# EAGLE design hoekdrive17-test-fixture (EAGLE 5.12)
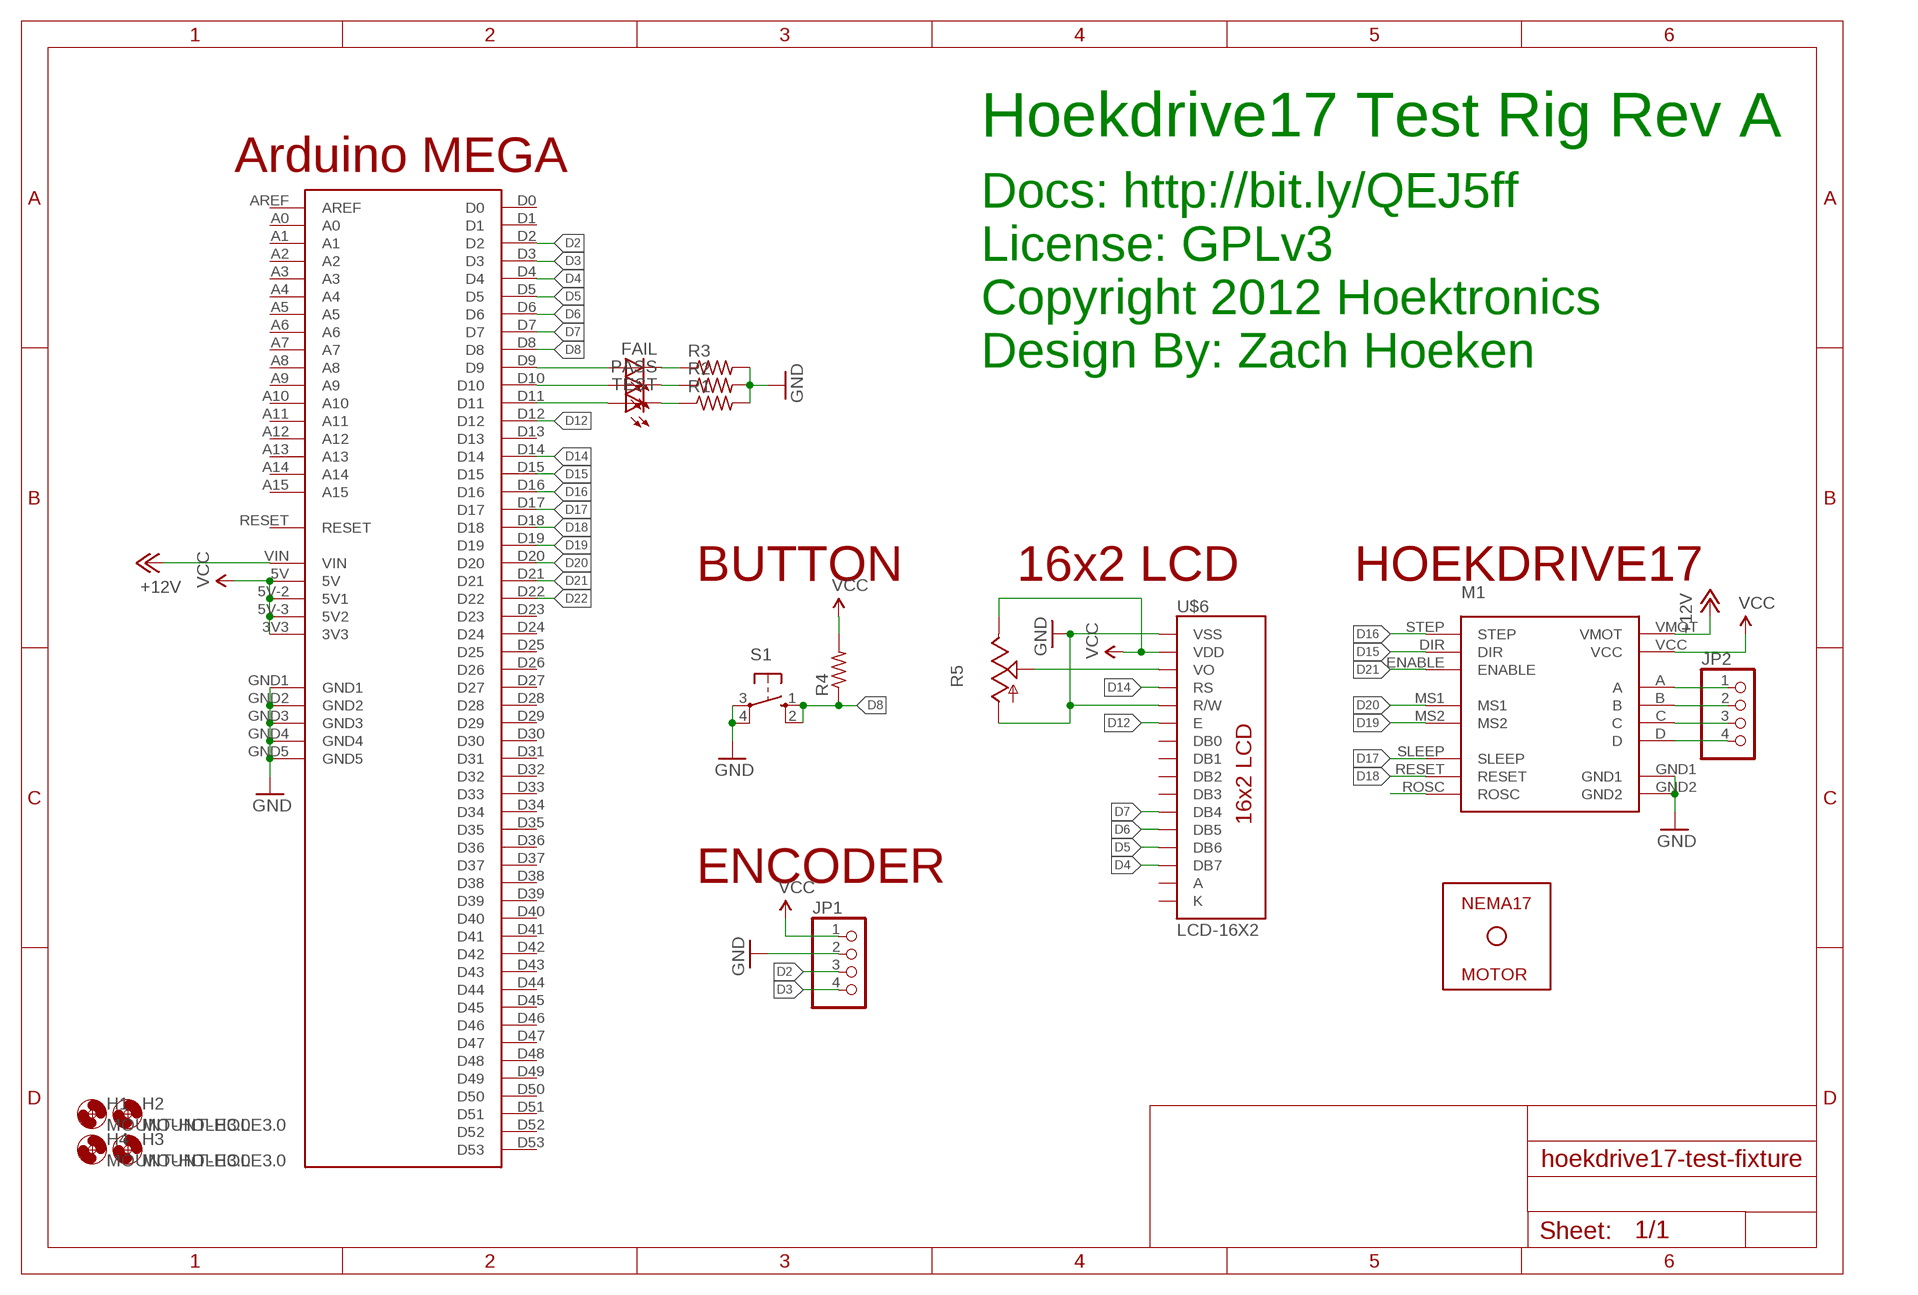
[diagram p0: schematic, sheet 1]

## Parts
FAIL  LED10MM  [LED10MM]
H1  MOUNT-HOLE3.0  [3,0]
H2  MOUNT-HOLE3.0  [3,0]
H3  MOUNT-HOLE3.0  [3,0]
H4  MOUNT-HOLE3.0  [3,0]
JP1  PINHD-1X4  [1X04]
JP2  PINHD-1X4  [1X04]
M1  HOEKSTEP17  [HOEKSTEP17]
PASS  LED10MM  [LED10MM]
R1  R-US_0207/7  [0207/7]
R2  R-US_0207/7  [0207/7]
R3  R-US_0207/7  [0207/7]
R4  R-US_0207/7  [0207/7]
R5  TRIM_US-B25U  [B25U]
S1  40-XX  [B3F-40XX]
TEST  LED10MM  [LED10MM]
U$1  ARDUINO-MEGA  [ARDUINO-MEGA]
U$3  NEMA17  [NEMA17]
U$6  LCD-16X2  [LCD-16X2]

## Nets
+12V: M1.VMOT U$1.VIN
D2: JP1.3 U$1.D2
D3: JP1.4 U$1.D3
D4: U$1.D4 U$6.14(DB7)
D5: U$1.D5 U$6.13(DB6)
D6: U$1.D6 U$6.12(DB5)
D7: U$1.D7 U$6.11(DB4)
D8: R4.1 S1.1(S) S1.2(S1) U$1.D8
D12: U$1.D12 U$6.6(E)
D14: U$1.D14 U$6.4(RS)
D15: M1.DIR U$1.D15
D16: M1.STEP U$1.D16
D17: M1.SLEEP U$1.D17
D18: M1.RESET U$1.D18
D19: M1.MS2 U$1.D19
D20: M1.MS1 U$1.D20
D21: M1.ENABLE U$1.D21
D22: U$1.D22
GND: JP1.2 M1.GND1 M1.GND2 R1.2 R2.2 R3.2 R5.A S1.3(P) S1.4(P1) U$1.GND1 U$1.GND2 U$1.GND3 U$1.GND4 U$1.GND5 U$6.1(VSS) U$6.5(R/W)
N$1: JP2.1 M1.A
N$2: JP2.2 M1.B
N$3: JP2.3 M1.C
N$4: JP2.4 M1.D
N$5: FAIL.A U$1.D9
N$6: PASS.A U$1.D10
N$7: TEST.A U$1.D11
N$8: FAIL.C R3.1
N$9: PASS.C R2.1
N$10: R1.1 TEST.C
N$18: M1.ROSC
N$19: R5.S U$6.3(VO)
VCC: JP1.1 M1.VCC R4.2 R5.E U$1.3V3 U$1.5V U$1.5V-2(5V1) U$1.5V-3(5V2) U$6.2(VDD)
Unconnected: U$1.A0 U$1.A1 U$1.A2 U$1.A3 U$1.A4 U$1.A5 U$1.A6 U$1.A7 U$1.A8 U$1.A9 U$1.A10 U$1.A11 U$1.A12 U$1.A13 U$1.A14 U$1.A15 U$1.AREF U$1.D0 U$1.D1 U$1.D13 U$1.D23 U$1.D24 U$1.D25 U$1.D26 U$1.D27 U$1.D28 U$1.D29 U$1.D30 U$1.D31 U$1.D32 U$1.D33 U$1.D34 U$1.D35 U$1.D36 U$1.D37 U$1.D38 U$1.D39 U$1.D40 U$1.D41 U$1.D42 U$1.D43 U$1.D44 U$1.D45 U$1.D46 U$1.D47 U$1.D48 U$1.D49 U$1.D50 U$1.D51 U$1.D52 U$1.D53 U$1.RESET U$6.7(DB0) U$6.8(DB1) U$6.9(DB2) U$6.10(DB3)

## Notes on the sheet
- Hoekdrive17 Test Rig Rev A
- Arduino MEGA
- Docs: http://bit.ly/QEJ5ff
- License: GPLv3
- Copyright 2012 Hoektronics
- Design By: Zach Hoeken
- BUTTON | 16x2 LCD | HOEKDRIVE17
- ENCODER

## Power pins joined to a net without a drawn wire
A: U$6.15(A)
K: U$6.16(K)

## Library data of the parts
FAIL PASS TEST = SparkFun:LED: LEDs Standard schematic elements and footprints for 5mm, 3mm, 1206, and 0603 sized LEDs. 5mm - Spark Fun Electronics SKU : COM-00529 (and others)
H1-H4 = holes:MOUNT-HOLE: MOUNTING HOLE with drill center marker
JP1 JP2 = pinhead:PINHD-1X4: PIN HEADER
M1 = Hoektronics:HOEKSTEP17
R1-R4 = resistor:R-US_: RESISTOR, American symbol
R5 = pot:TRIM_US-: POTENTIOMETER
S1 = switch-omron:40-XX: OMRON SWITCH; MF: OMRON COMPONENTS USA; MPN: B3F-4000; OC_FARNELL: 176434; OC_NEWARK: 36K3105
U$1 = MakerBot:ARDUINO-MEGA
U$3 = Hoektronics:NEMA17
U$6 = SparkFun:LCD-16X2

## Net classes
0 default: width 0.381 mm, clearance 0.381 mm

## Board
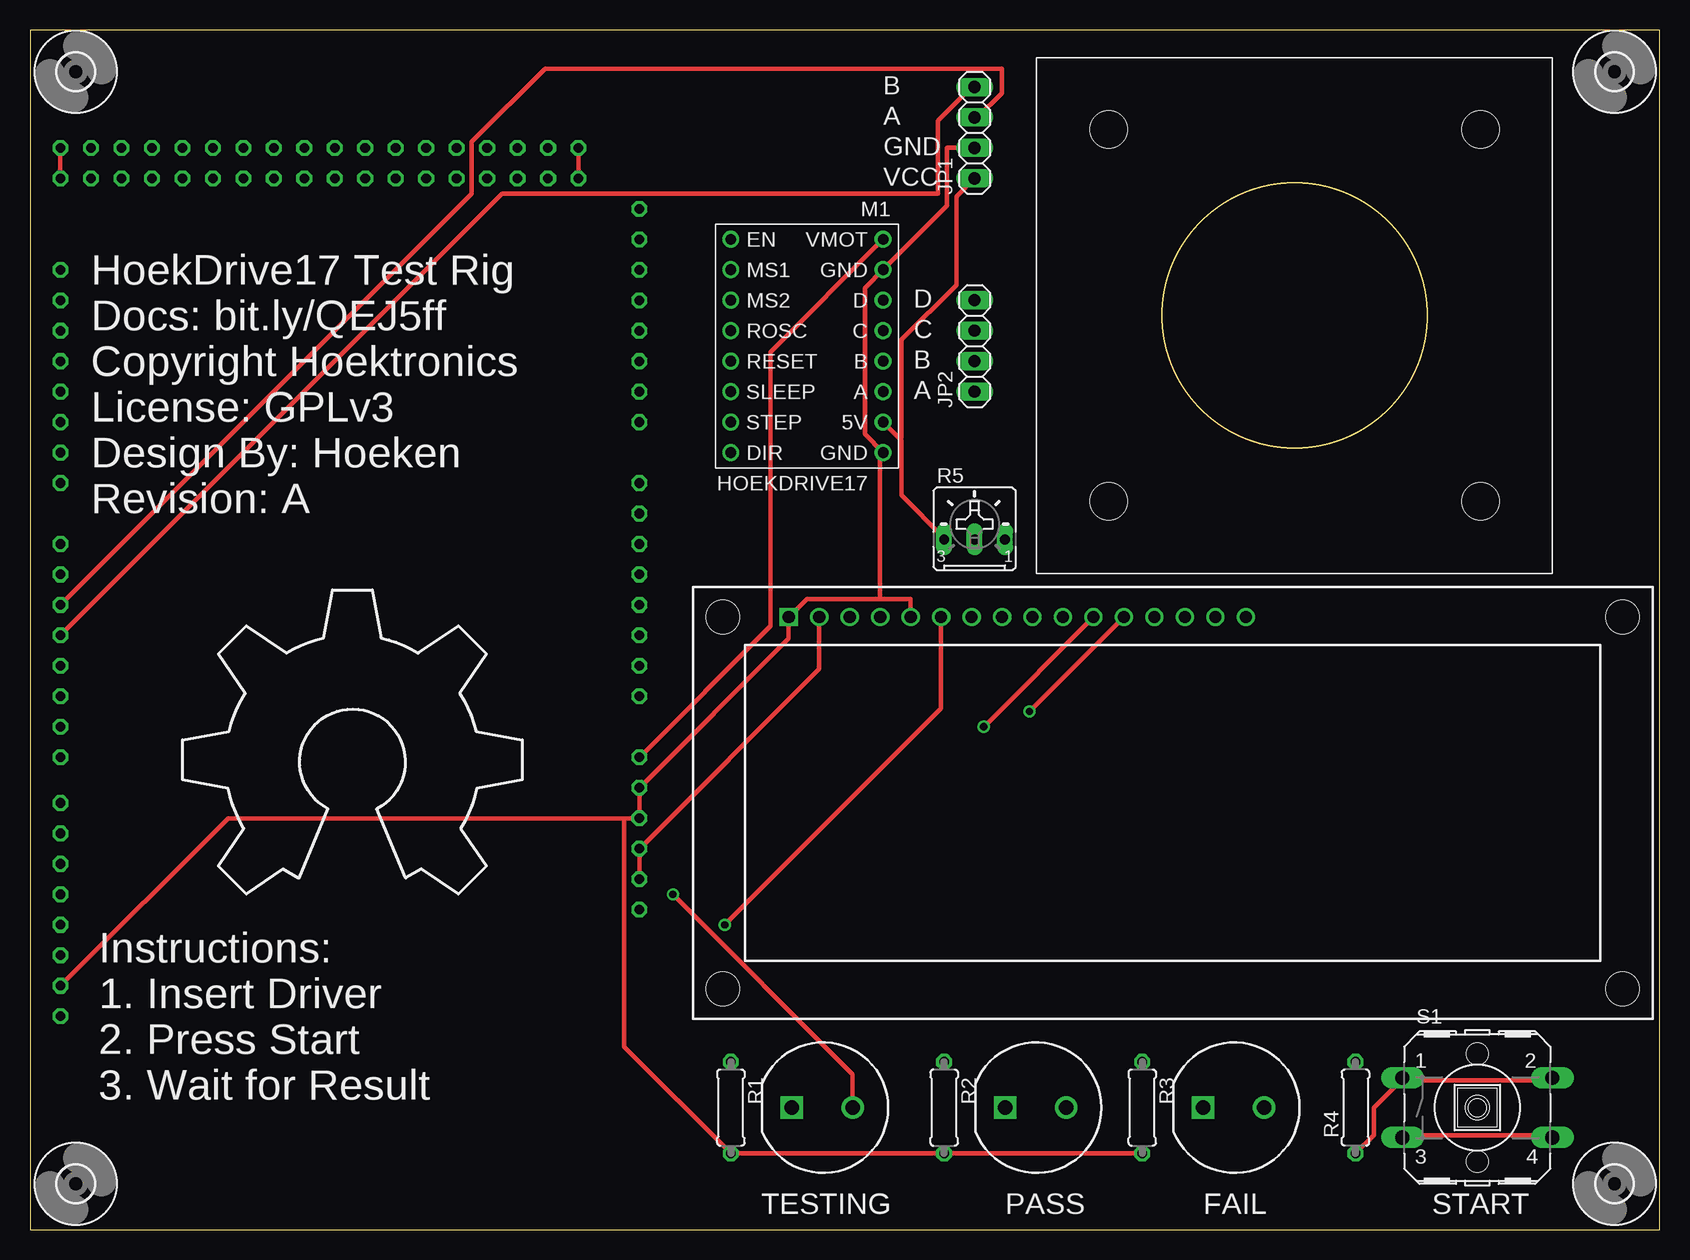
[diagram p1: board, top side]
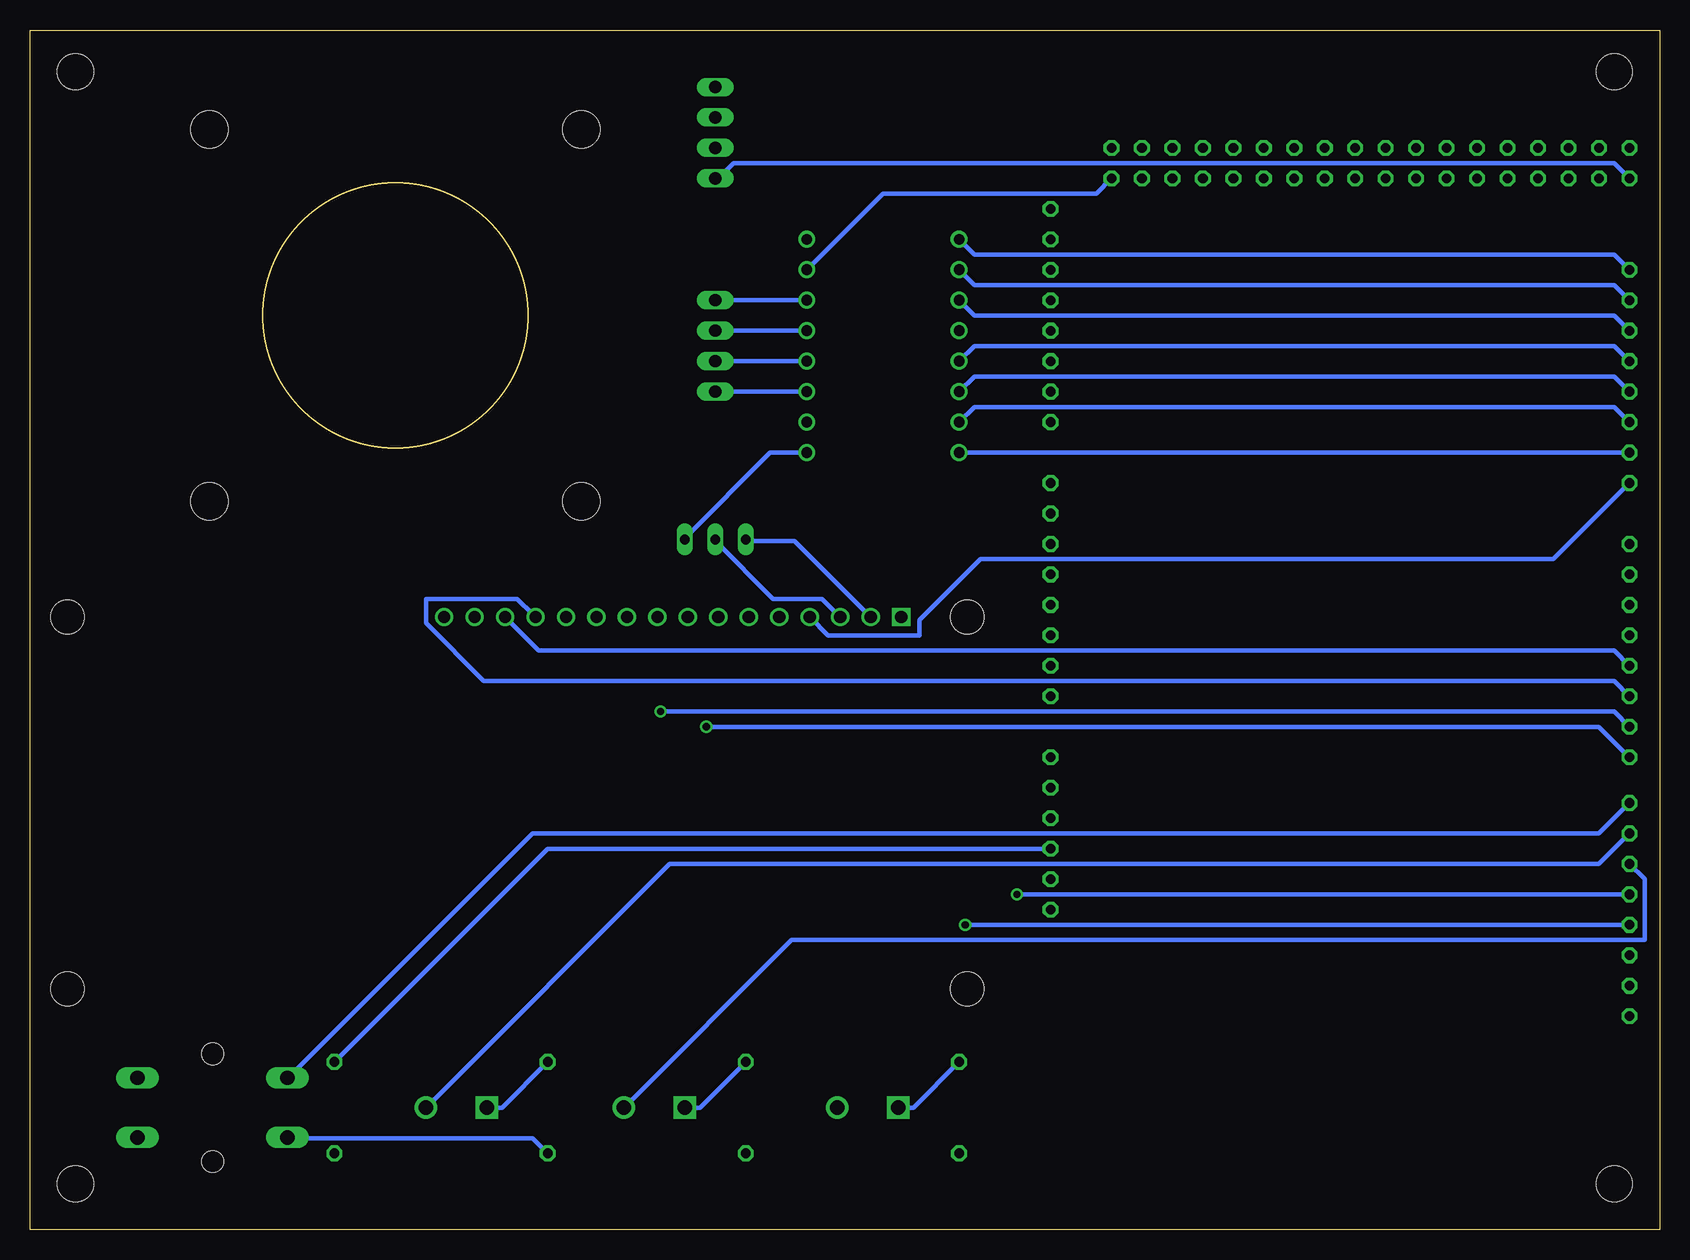
[diagram p2: board, bottom side, seen from below]

Size 135.87 x 100 mm. Coordinates in mm from the lower left corner, seen from the top.
Outline: 0,0 135.87,0 135.87,100 0,100 0,0
Copper layers (1*16): Top 0.035mm / dielectric 1.5mm / Bottom 0.035mm
Design rules "default": minimum track width 10mil, minimum drill 24mil, track to track 8mil, track to pad 8mil, pad to pad 8mil, via to via 8mil, smd to smd 8mil, copper to edge 40mil, drill to drill 8mil, minimum pad ring 10mil, minimum via ring 8mil, stop-mask expansion 4mil, vias tented up to drill 0mil, thermal gap 10mil

### Footprints (pad centres in the part's own frame; a part is rotated, then mirrored left to right if it is on the bottom)
LED10MM = drill 1.2 pad 1.88 round: A 2.54,0 | drill 1.2 pad 1.88 square: C -2.54,0
3,0 = hole 3: 0,0
1X04 = drill 1.016 long: 1 -3.81,0; 2 -1.27,0; 3 1.27,0; 4 3.81,0
HOEKSTEP17 = drill 0.9 round: A -6.35,-5.08; B -6.35,-7.62; C -6.35,-10.16; D -6.35,-12.7; DIR 6.35,0; ENABLE 6.35,-17.78; GND1 -6.35,0; GND2 -6.35,-15.24; MS1 6.35,-15.24; MS2 6.35,-12.7; RESET 6.35,-7.62; ROSC 6.35,-10.16; SLEEP 6.35,-5.08; STEP 6.35,-2.54; VCC -6.35,-2.54; VMOT -6.35,-17.78
0207/7 = drill 0.813 octagon: 1 -3.81,0; 2 3.81,0
B25U = drill 0.813 long: A 2.54,-0.889; E -2.54,-0.889; S 0,-0.889
B3F-40XX = drill 1.194 long: 1 -6.248,2.489; 2 6.248,2.489; 3 -6.248,-2.489; 4 6.248,-2.489 | hole 1.803: 0,-4.496; 0,4.496
ARDUINO-MEGA = drill 0.8 octagon: 3V3 35.56,2.54; 5V 93.98,50.8; 5V-2 96.52,50.8; 5V-3 38.1,2.54; A0 50.8,2.54; A1 53.34,2.54; A2 55.88,2.54; A3 58.42,2.54; A4 60.96,2.54; A5 63.5,2.54; A6 66.04,2.54; A7 68.58,2.54; A8 73.66,2.54; A9 76.2,2.54; A10 78.74,2.54; A11 81.28,2.54; A12 83.82,2.54; A13 86.36,2.54; A14 88.9,2.54; A15 91.44,2.54; AREF 24.13,50.8; D0 63.5,50.8; D1 60.96,50.8; D2 58.42,50.8; D3 55.88,50.8; D4 53.34,50.8; D5 50.8,50.8; D6 48.26,50.8; D7 45.72,50.8; D8 41.91,50.8; D9 39.37,50.8; D10 36.83,50.8; D11 34.29,50.8; D12 31.75,50.8; D13 29.21,50.8; D14 68.58,50.8; D15 71.12,50.8; D16 73.66,50.8; D17 76.2,50.8; D18 78.74,50.8; D19 81.28,50.8; D20 83.82,50.8; D21 86.36,50.8; D22 93.98,48.26; D23 96.52,48.26; D24 93.98,45.72; D25 96.52,45.72; D26 93.98,43.18; D27 96.52,43.18; D28 93.98,40.64; D29 96.52,40.64; D30 93.98,38.1; D31 96.52,38.1; D32 93.98,35.56; D33 96.52,35.56; D34 93.98,33.02; D35 96.52,33.02; D36 93.98,30.48; D37 96.52,30.48; D38 93.98,27.94; D39 96.52,27.94; D40 93.98,25.4; D41 96.52,25.4; D42 93.98,22.86; D43 96.52,22.86; D44 93.98,20.32; D45 96.52,20.32; D46 93.98,17.78; D47 96.52,17.78; D48 93.98,15.24; D49 96.52,15.24; D50 93.98,12.7; D51 96.52,12.7; D52 93.98,10.16; D53 96.52,10.16; GND1 26.67,50.8; GND2 93.98,7.62; GND3 96.52,7.62; GND4 40.64,2.54; GND5 43.18,2.54; RESET 33.02,2.54; VIN 45.72,2.54
NEMA17 = hole 3.1: 15.5,-15.5; 15.5,15.5; -15.5,15.5; -15.5,-15.5
LCD-16X2 = drill 1.016 square: 1 -32,15.5 | drill 1.016 round: 2 -29.46,15.5; 3 -26.92,15.5; 4 -24.38,15.5; 5 -21.84,15.5; 6 -19.3,15.5; 7 -16.76,15.5; 8 -14.22,15.5; 9 -11.68,15.5; 10 -9.14,15.5; 11 -6.6,15.5; 12 -4.06,15.5; 13 -1.52,15.5; 14 1.02,15.5; 15 3.56,15.5; 16 6.1,15.5 | hole 2.8: -37.5,15.5; -37.5,-15.5; 37.5,15.5; 37.5,-15.5

### Placement (x,y rotation side)
FAIL  100.33,10.16 0 top
H1  3.81,3.81 0 top
H2  132.08,3.81 0 top
H3  132.08,96.52 0 top
H4  3.81,96.52 0 top
JP1  78.74,91.44 90 top
JP2  78.74,73.66 90 top
M1  64.77,64.77 180 top
PASS  83.82,10.16 0 top
R1  58.42,10.16 270 top
R2  76.2,10.16 270 top
R3  92.71,10.16 270 top
R4  110.49,10.16 90 top
R5  78.74,58.42 0 top
S1  120.65,10.16 0 top
TEST  66.04,10.16 0 top
U$1  53.34,-6.35 90 top
U$2  [OSHW_10X1000_NOTEXT]  12.7,27.94 0 top
U$3  105.41,76.2 0 top
U$6  95.25,35.56 0 top

### Tracks (layer width: path | path; a pad name or v marks a point on that pad's centre or on a via)
+12V
  Top 0.381: U$1.VIN 61.72,50.29 61.72,73.15 M1.VMOT
D2
  Top 0.381: U$1.D2 36.83,86.36 36.83,90.68 42.93,96.77 81.03,96.77 81.03,94.74 78.99,92.71 JP1.3
D3
  Top 0.381: U$1.D3 39.37,86.36 75.69,86.36 75.69,92.46 78.49,95.25 JP1.4
D4
  Bottom 0.381: U$1.D4 3.81,48.26 93.47,48.26 U$6.14
D5
  Bottom 0.381: U$1.D5 3.81,45.72 98.04,45.72 102.87,50.55 102.87,52.58 95.25,52.58 93.98,51.31 U$6.13
D6  (via drill 0.61)
  Top 0.381: v83.31,43.18 U$6.12
  Bottom 0.381: U$1.D6 3.81,43.18 v83.31,43.18
D7  (via drill 0.61)
  Top 0.381: v79.5,41.91 U$6.11
  Bottom 0.381: U$1.D7 5.08,41.91 v79.5,41.91
D8
  Top 0.381: R4.1 112.01,7.87 112.01,10.16 114.3,12.45 S1.1 114.55,12.45 126.75,12.45 S1.2
  Bottom 0.381: U$1.D8 5.08,33.02 93.98,33.02 114.3,12.7 S1.1
D12  (via drill 0.61)
  Top 0.381: v57.91,25.4 75.95,43.43 U$6.6
  Bottom 0.381: U$1.D12 v57.91,25.4
D14
  Bottom 0.381: U$1.D14 8.89,55.88 56.64,55.88 61.72,50.8 61.72,49.53 69.34,49.53 U$6.4
D15
  Bottom 0.381: U$1.D15 M1.DIR
D16
  Bottom 0.381: U$1.D16 3.81,68.58 57.15,68.58 M1.STEP
D17
  Bottom 0.381: U$1.D17 3.81,71.12 57.15,71.12 M1.SLEEP
D18
  Bottom 0.381: U$1.D18 3.81,73.66 57.15,73.66 M1.RESET
D19
  Bottom 0.381: U$1.D19 3.81,76.2 57.15,76.2 M1.MS2
D20
  Bottom 0.381: U$1.D20 3.81,78.74 57.15,78.74 M1.MS1
D21
  Bottom 0.381: U$1.D21 3.81,81.28 57.15,81.28 M1.ENABLE
GND
  Top 0.381: S1.3 114.55,7.87 126.75,7.87 S1.4 | R3.2 R2.2 R1.2 49.53,15.24 49.53,34.29 | U$1.GND1 16.51,34.29 49.53,34.29 | 49.53,34.29 U$1.GND4 U$1.GND5 63.25,49.28 U$6.1 63.5,51.31 64.77,52.58 70.87,52.58 | 70.87,52.58 73.41,52.58 73.41,51.31 U$6.5 | U$1.GND2 U$1.GND3 | JP1.2 76.45,90.17 76.45,85.34 M1.GND2 69.6,78.49 69.6,66.29 M1.GND1 70.87,64.77 70.87,52.58
  Bottom 0.381: R3.2 93.98,7.62 114.3,7.62 S1.3 | M1.GND1 74.17,64.77 81.28,57.66 R5.A | U$1.GND2 46.99,86.36 64.77,86.36 M1.GND2
N$1
  Bottom 0.381: M1.A JP2.1
N$2
  Bottom 0.381: M1.B JP2.2
N$3
  Bottom 0.381: M1.C JP2.3
N$4
  Bottom 0.381: M1.D JP2.4
N$5
  Bottom 0.381: U$1.D9 5.08,30.48 82.55,30.48 FAIL.A
N$6
  Bottom 0.381: U$1.D10 1.27,29.21 1.27,24.13 72.39,24.13 PASS.A
N$7  (via drill 0.61)
  Top 0.381: v53.59,27.94 68.58,12.95 TEST.A
  Bottom 0.381: U$1.D11 v53.59,27.94
N$8
  Bottom 0.381: R3.1 96.52,10.16 FAIL.C
N$9
  Bottom 0.381: R2.1 80.01,10.16 PASS.C
N$10
  Bottom 0.381: R1.1 62.23,10.16 TEST.C
N$19
  Bottom 0.381: R5.S 78.74,57.4 73.91,52.58 69.85,52.58 68.58,51.31 U$6.3
VCC
  Top 0.381: U$1.3V3 U$1.5V-3 65.79,46.74 U$6.2 | U$1.5V U$1.5V-2 | 72.52,65.91 M1.VCC | 72.52,65.91 72.64,65.79 72.64,61.21 76.2,57.66 R5.E | JP1.1 77.22,86.11 77.22,78.74 72.64,74.17 72.64,66.04 72.52,65.91
  Bottom 0.381: R4.2 92.71,31.75 U$1.5V-3 | U$6.2 66.04,51.31 72.14,57.4 76.2,57.4 R5.E | U$1.5V 3.81,88.9 77.22,88.9 78.49,87.63 JP1.1

### Text on the board
tPlace: B | A | GND | VCC | HoekDrive17 Test Rig | D | Docs: bit.ly/QEJ5ff | C | B | Copyright Hoektronics | A | License: GPLv3 | Design By: Hoeken | Revision: A | Instructions: | 1. Insert Driver | 2. Press Start | 3. Wait for Result | TESTING | PASS | FAIL | START